# EAGLE schematic lt8471 (EAGLE 9.5.1)
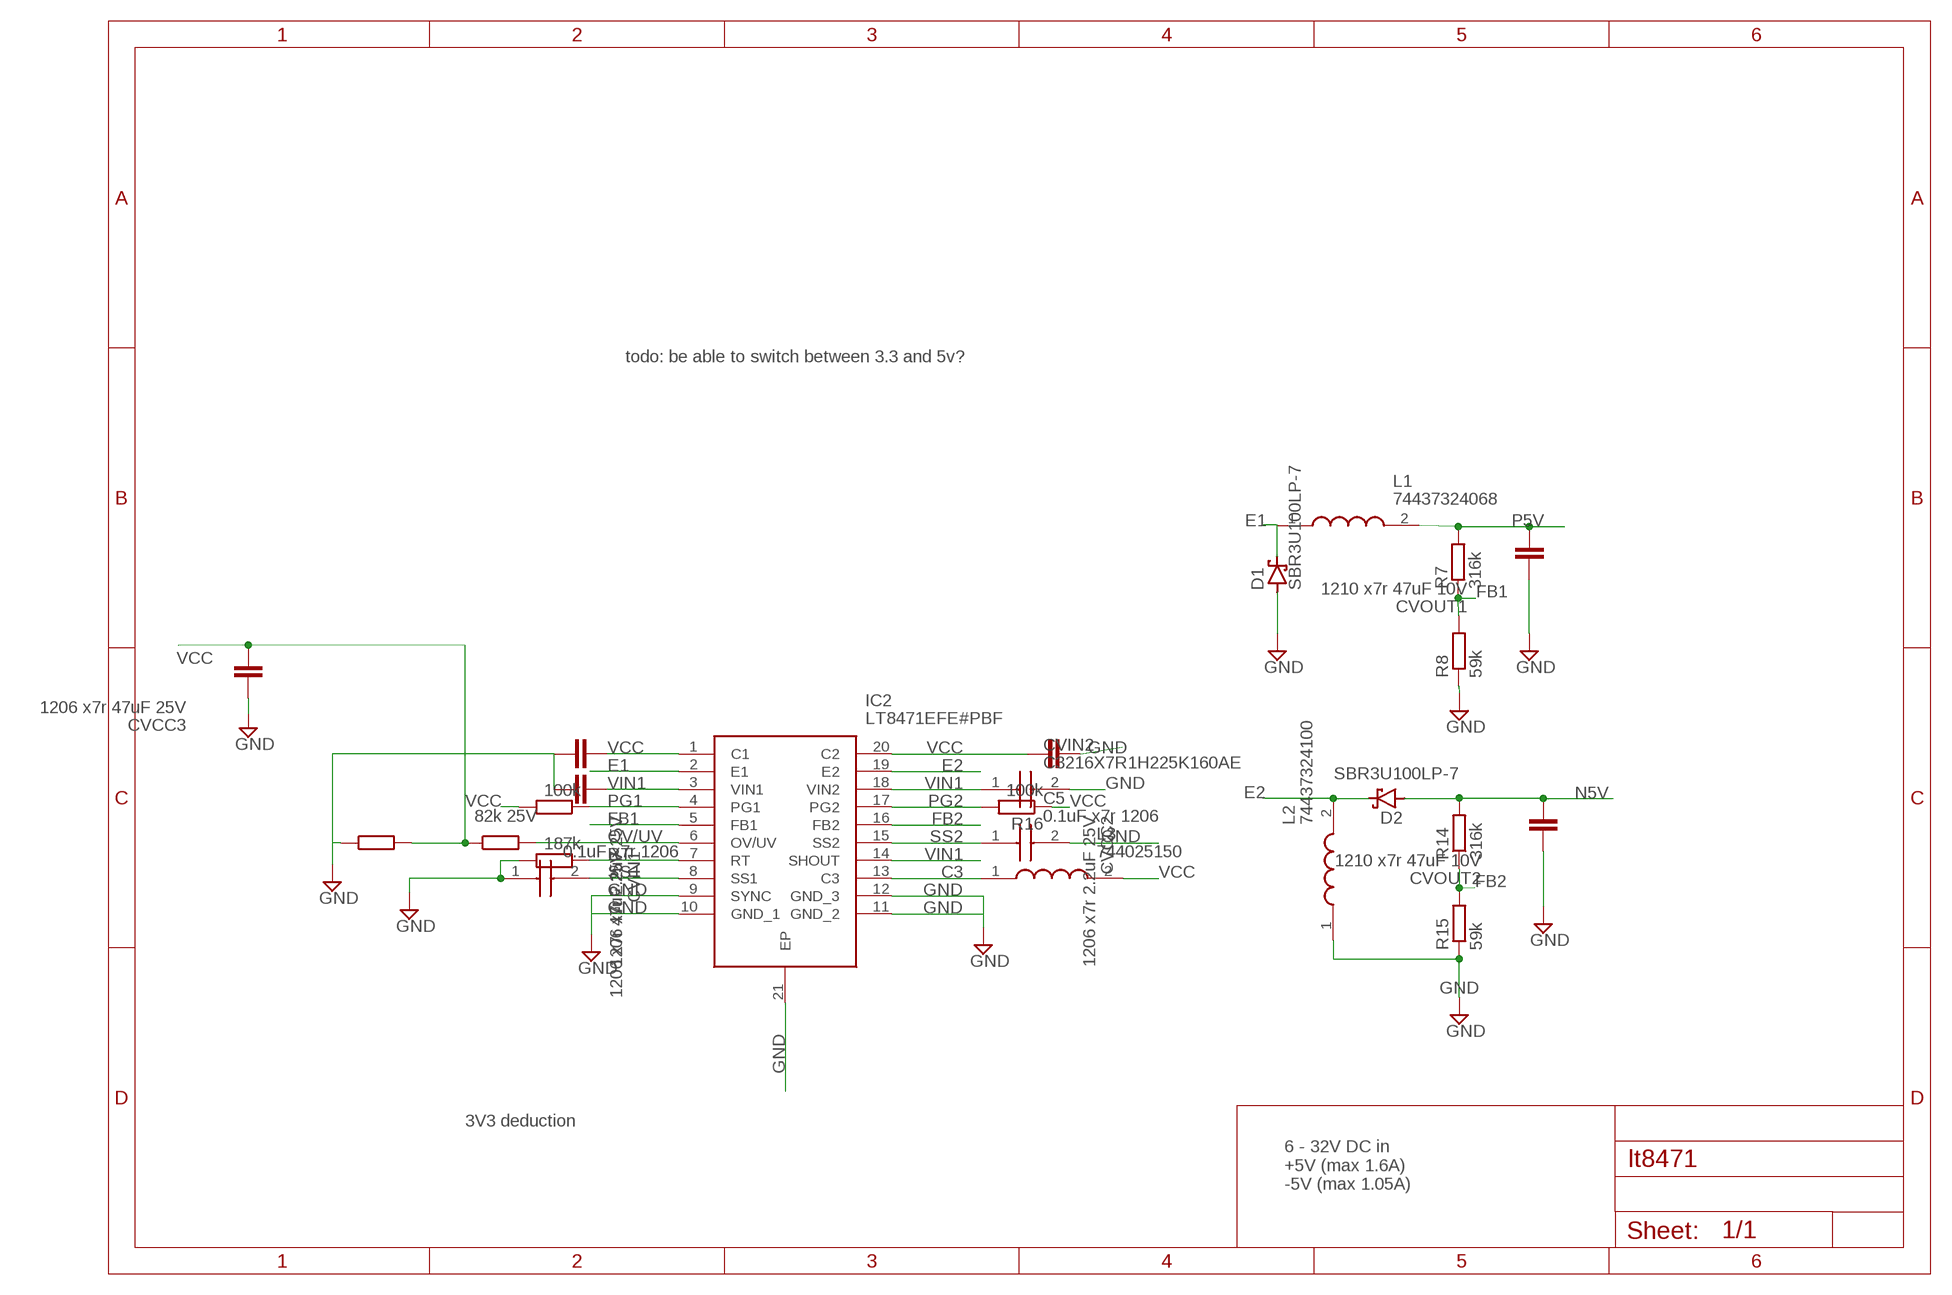
[diagram p0: schematic, sheet 1]

## Parts
C3  0.1uF x7r 1206  MCSH31B104K500CT  [CAPC3416X90N]
C5  0.1uF x7r 1206  MCSH31B104K500CT  [CAPC3416X90N]
CVCC1  1206 x7r 2.2uF 25V  C-EUC1206  [C1206]
CVCC2  1206 x7r 2.2uF 25V  C-EUC1206  [C1206]
CVCC3  1206 x7r 47uF 25V  C-EUC1210  [C1210]
CVIN1  1206 x7r 47uF 25V  C-EUC1210  [C1210]
CVIN2  C3216X7R1H225K160AE  [CAPC3216X180N]
CVOUT1  1210 x7r 47uF 10V  C-EUC1210  [C1210]
CVOUT2  1210 x7r 47uF 10V  C-EUC1210  [C1210]
D1  SBR3U100LP-7  [SBR3U100LP7]
D2  SBR3U100LP-7  [SBR3U100LP7]
IC2  LT8471EFE#PBF  [SOP65P640X120-21N]
L1  74437324068  [WE-LHMI_402048]
L2  74437324100  [WE-LHMI_402048]
L3  744025150  [WE-TPC_282892]
R5  261k 25V  R-EU_M1206  [M1206]
R6  82k 25V  R-EU_M1206  [M1206]
R7  316k  R-EU_R1206  [R1206]
R8  59k  R-EU_R1206  [R1206]
R14  316k  R-EU_R1206  [R1206]
R15  59k  R-EU_R1206  [R1206]
R16  100k  R-EU_R1206  [R1206]
R17  100k  R-EU_R1206  [R1206]
R18  187k  R-EU_R1206  [R1206]

## Nets
C3: IC2.13(C3) L3.1
E1 [switching]: D1.5(C) IC2.2(E1) L1.1
E2 [power]: D2.5(C) IC2.19(E2) L2.2
FB1: IC2.5(FB1) R7.1 R8.2
FB2: IC2.16(FB2) R14.1 R15.2
GND [power]: C3.1 C5.2 CVCC1.2 CVCC2.1 CVCC3.1 CVIN1.2 CVIN2.2 CVOUT1.1 CVOUT2.1 D1.1(A) D1.2(A) D1.3(A) D1.4(A) IC2.9(SYNC) IC2.10(GND_1) IC2.11(GND_2) IC2.12(GND_3) IC2.21(EP) L2.1 R6.1 R8.1 R15.1 R18.2
N5V [power]: CVOUT2.2 D2.1(A) D2.2(A) D2.3(A) D2.4(A) R14.2
OV/UV: IC2.6(OV/UV) R5.2
P5V [power]: CVOUT1.2 L1.2 R7.2
PG1: IC2.4(PG1) R17.1
PG2: IC2.17(PG2) R16.2
RT: IC2.7(RT) R18.1
SS1: C3.2 IC2.8(SS1)
SS2: C5.1 IC2.15(SS2)
VCC [power]: CVCC1.1 CVCC2.2 CVCC3.2 IC2.1(C1) IC2.20(C2) L3.2 R5.1 R6.2 R16.1 R17.2
VIN1: CVIN1.1 CVIN2.1 IC2.3(VIN1) IC2.14(SHOUT) IC2.18(VIN2)

## Notes on the sheet
- todo: be able to switch between 3.3 and 5v?
- 3V3 deduction
- 6 - 32V DC in
  +5V (max 1.6A)
  -5V (max 1.05A)

## Library data of the parts
C3 C5 = samacsys:MCSH31B104K500CT: MULTICOMP - MCSH31B104K500CT - CAP, MLCC, X7R, 100NF, 50V, 1206 Source: Datasheet <http://www.farnell.com/datasheets/1825494.pdf>; DESCRIPTION: MULTICOMP - MCSH31B104K500CT - CAP, MLCC, X7R, 100NF, 50V, 1206; HEIGHT: 0.9mm; MANUFACTURER_NAME: MULTICOMP; MANUFACTURER_PART_NUMBER: MCSH31B104K500CT
CVCC1-CVCC3 CVIN1 CVOUT1 CVOUT2 = rcl:C-EU: CAPACITOR, European symbol; SPICEPREFIX: C
CVIN2 = samacsys:C3216X7R1H225K160AE: Multilayer Ceramic Capacitors MLCC - SMD/SMT 3216 2.2uF 50volts X7R 10% Soft Term Source: Datasheet <https://product.tdk.com/info/en/catalog/datasheets/mlcc_commercial_midvoltage_en.pdf>; DESCRIPTION: Multilayer Ceramic Capacitors MLCC - SMD/SMT 3216 2.2uF 50volts X7R 10% Soft Term; HEIGHT: 1.8mm; MANUFACTURER_NAME: TDK; MANUFACTURER_PART_NUMBER: C3216X7R1H225K160AE; MOUSER_PART_NUMBER: 810-C3216X7R1H225KST; MOUSER_PRICE-STOCK: http://www.mouser.com/Search/ProductDetail.aspx?qs=LcTL%2f5vFEzF%2fV37W3zk7cA%3d%3d
D1 D2 = wouter:SBR3U100LP-7: Diodes Inc SBR3U100LP-7 Switching Diode, 8-Pin U-DFN3030 Source: Datasheet <https://www.diodes.com/assets/Datasheets/SBR3U100LP.pdf>; DESCRIPTION: Diodes Inc SBR3U100LP-7 Switching Diode, 8-Pin U-DFN3030; HEIGHT: 0.63mm; MANUFACTURER_NAME: Diodes Inc.; MANUFACTURER_PART_NUMBER: SBR3U100LP-7; MOUSER_PART_NUMBER: 621-SBR3U100LP-7; MOUSER_PRICE-STOCK: https://www.mouser.com/Search/Refine.aspx?Keyword=621-SBR3U100LP-7; RS_PART_NUMBER: 8855599P; RS_PRICE-STOCK: http://uk.rs-online.com/web/p/products/8855599P
IC2 = samacsys:LT8471EFE#PBF: Linear Technology LT8471EFE#PBF, Dual, DC-DC DC-DC Converter, Adjustable, 1.35A 20-Pin, TSSOP Source: Datasheet <https://www.analog.com/media/en/technical-documentation/data-sheets/8471fd.pdf>; DESCRIPTION: Linear Technology LT8471EFE#PBF, Dual, DC-DC DC-DC Converter, Adjustable, 1.35A 20-Pin, TSSOP; HEIGHT: 1.2mm; MANUFACTURER_NAME: Linear Technology; MANUFACTURER_PART_NUMBER: LT8471EFE#PBF; MOUSER_PART_NUMBER: 584-LT8471EFE#PBF; MOUSER_PRICE-STOCK: https://www.mouser.com/Search/Refine.aspx?Keyword=584-LT8471EFE%23PBF; RS_PART_NUMBER: 1513320; RS_PRICE-STOCK: http://uk.rs-online.com/web/p/products/1513320
L1 = samacsys:74437324068: SMD Power Inductor WE-LHMI Source: Datasheet <http://componentsearchengine.com/Datasheets/1/74437324068.pdf>; DESCRIPTION: SMD Power Inductor WE-LHMI; HEIGHT: mm; MANUFACTURER_NAME: Wurth Elektronik; MANUFACTURER_PART_NUMBER: 74437324068; MOUSER_PART_NUMBER: 710-74437324068; MOUSER_PRICE-STOCK: https://www.mouser.com/Search/Refine.aspx?Keyword=710-74437324068; RS_PART_NUMBER: 7568480P; RS_PRICE-STOCK: http://uk.rs-online.com/web/p/products/7568480P
L2 = samacsys:74437324100: SMD Power Inductor WE-LHMI Source: Datasheet <http://componentsearchengine.com/Datasheets/1/74437324100.pdf>; DESCRIPTION: SMD Power Inductor WE-LHMI; HEIGHT: mm; MANUFACTURER_NAME: Wurth Elektronik; MANUFACTURER_PART_NUMBER: 74437324100; MOUSER_PART_NUMBER: 710-74437324100; MOUSER_PRICE-STOCK: https://www.mouser.com/Search/Refine.aspx?Keyword=710-74437324100; RS_PART_NUMBER: 7568487P; RS_PRICE-STOCK: http://uk.rs-online.com/web/p/products/7568487P
L3 = samacsys:744025150: Wurth WE-TPC Series Shielded Wire-wound SMD Inductor with a Ferrite Core, 15 H 20% 900mA Idc Source: Datasheet; DESCRIPTION: Wurth WE-TPC Series Shielded Wire-wound SMD Inductor with a Ferrite Core, 15 H 20% 900mA Idc; HEIGHT: mm; MANUFACTURER_NAME: Wurth Elektronik; MANUFACTURER_PART_NUMBER: 744025150; MOUSER_PART_NUMBER: 710-744025150; MOUSER_PRICE-STOCK: https://www.mouser.com/Search/Refine.aspx?Keyword=710-744025150; RS_PART_NUMBER: 7373639P; RS_PRICE-STOCK: http://uk.rs-online.com/web/p/products/7373639P
R5 R6 = resistor:R-EU_: RESISTOR, European symbol
R7 R8 R14-R18 = rcl:R-EU_: RESISTOR, European symbol; SPICEPREFIX: R

## Net classes
1 switching: width 0.3 mm
2 power: width 0.4 mm